# Altium schematic sheet connectors.SchDoc
size A4
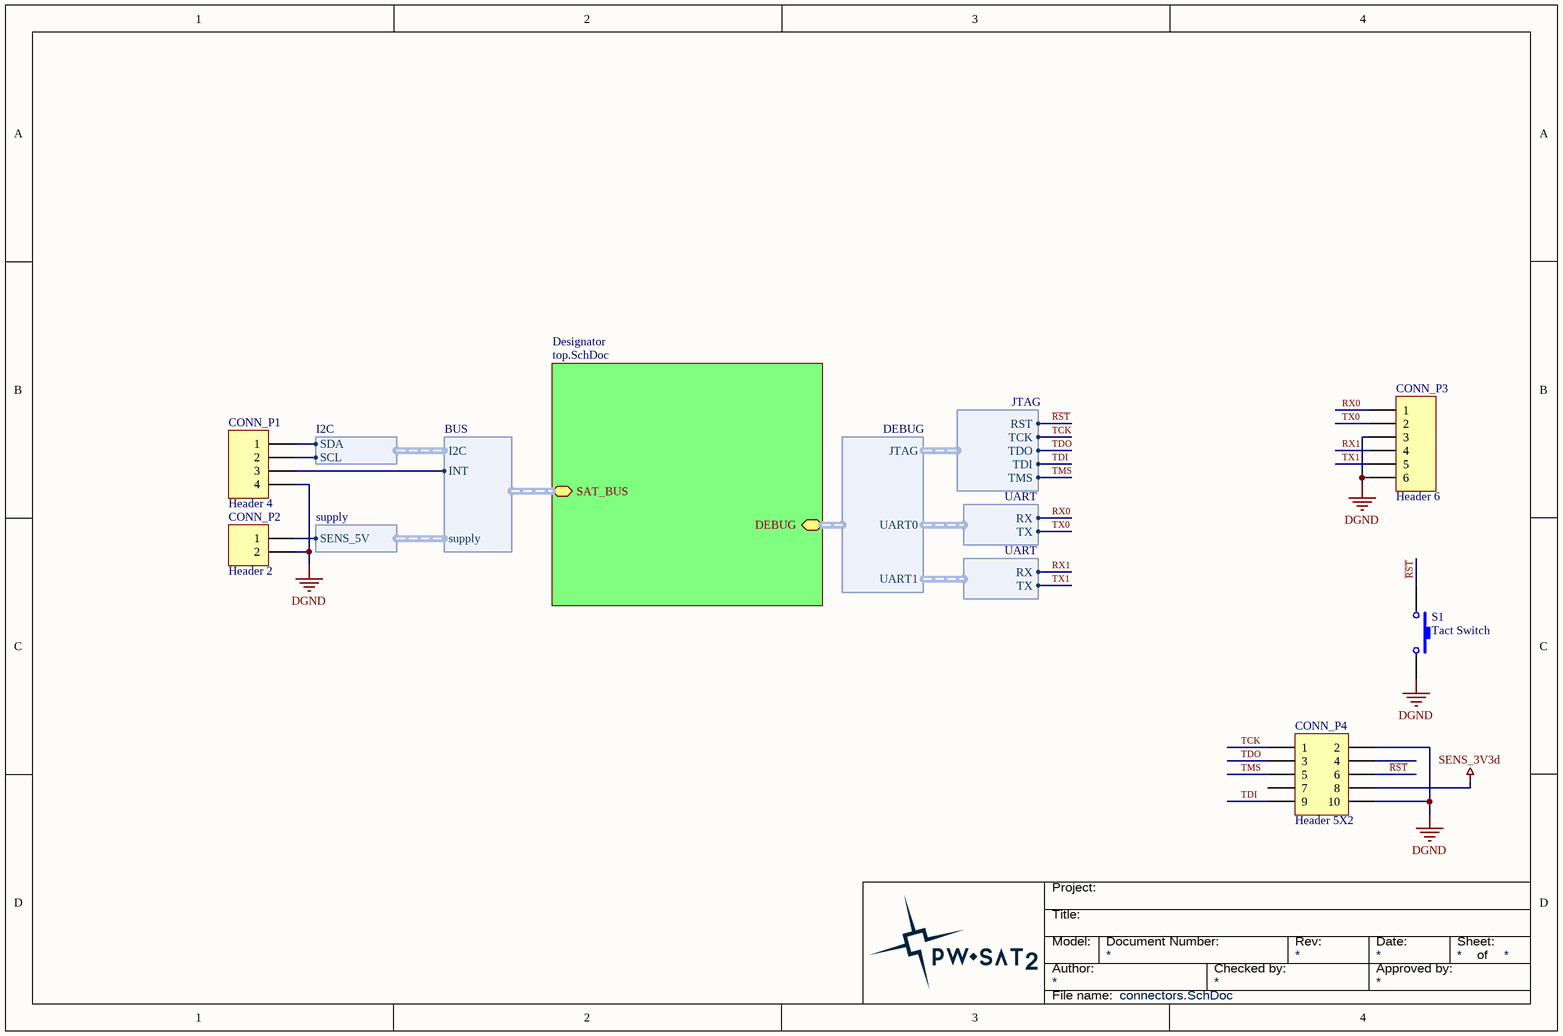
[diagram p0: connectors.SchDoc]

## Parts
CONN_P1  Header 4  [HEADER 1x4 MALE]
CONN_P2  Header 2  [HEADER 1X2 Male]
CONN_P3  Header 6  [HEADER 1X6 MALE]
CONN_P4  Header 5X2  [HEADER 2X5 MALE]
S1  Tact Switch  [Tact Switch 3x6]

## Sub-sheets
Designator = top.SchDoc: SAT_BUS (harness BUS), DEBUG (harness DEBUG)

## Harnesses
BUS: I2C, supply, INT
I2C: SDA, SCL
supply: SENS_5V
DEBUG: JTAG, UART0, UART1
JTAG: RST, TCK, TDO, TDI, TMS
UART: RX, TX

## Nets
DGND: CONN_P1.4 CONN_P2.2 CONN_P3.3 CONN_P3.6 CONN_P4.2 CONN_P4.10 S1.2
SENS_3V3d: CONN_P4.8
~{RST}: CONN_P4.6 S1.1 ; harness JTAG.RST
RX0: CONN_P3.1 ; harness UART.RX
RX1: CONN_P3.4 ; harness UART.RX
TCK: CONN_P4.1 ; harness JTAG.TCK
TDI: CONN_P4.9 ; harness JTAG.TDI
TDO: CONN_P4.3 ; harness JTAG.TDO
TMS: CONN_P4.5 ; harness JTAG.TMS
TX0: CONN_P3.2 ; harness UART.TX
TX1: CONN_P3.5 ; harness UART.TX
NetCONN_P1_1: CONN_P1.1 ; harness I2C.SDA
NetCONN_P1_2: CONN_P1.2 ; harness I2C.SCL
NetCONN_P1_3: CONN_P1.3 ; sheet Designator/SAT_BUS.INT
NetCONN_P2_1: CONN_P2.1 ; harness supply.SENS_5V

Not connected (* = marked no-connect by the designer): CONN_P4 4 7

## Notes on the sheet
- Title:
- Project:
- Author:
- Model:
- Document Number:
- Checked by:
- Rev:
- Date:
- Approved by:
- Sheet:
- of
- File name:

## Library data of the parts
CONN_P1 = Header 4: Header, 4-Pin; LatestRevisionDate: 17-Jul-2002; LatestRevisionNote: Re-released for DXP Platform.; Publisher: Altium Limited
CONN_P2 = Header 2: Header, 2-Pin; LatestRevisionDate: 17-Jul-2002; LatestRevisionNote: Re-released for DXP Platform.; Publisher: Altium Limited
CONN_P3 = Header 6: Header, 6-Pin; LatestRevisionDate: 17-Jul-2002; LatestRevisionNote: Re-released for DXP Platform.; Publisher: Altium Limited
CONN_P4 = Header 5X2: Header, 5-Pin, Dual row
S1 = TactSwitch: Supplier 1: Farnell